# Altium schematic sheet STORAGE.SchDoc
size A4; SheetNumber: 4; SheetTotal: 6
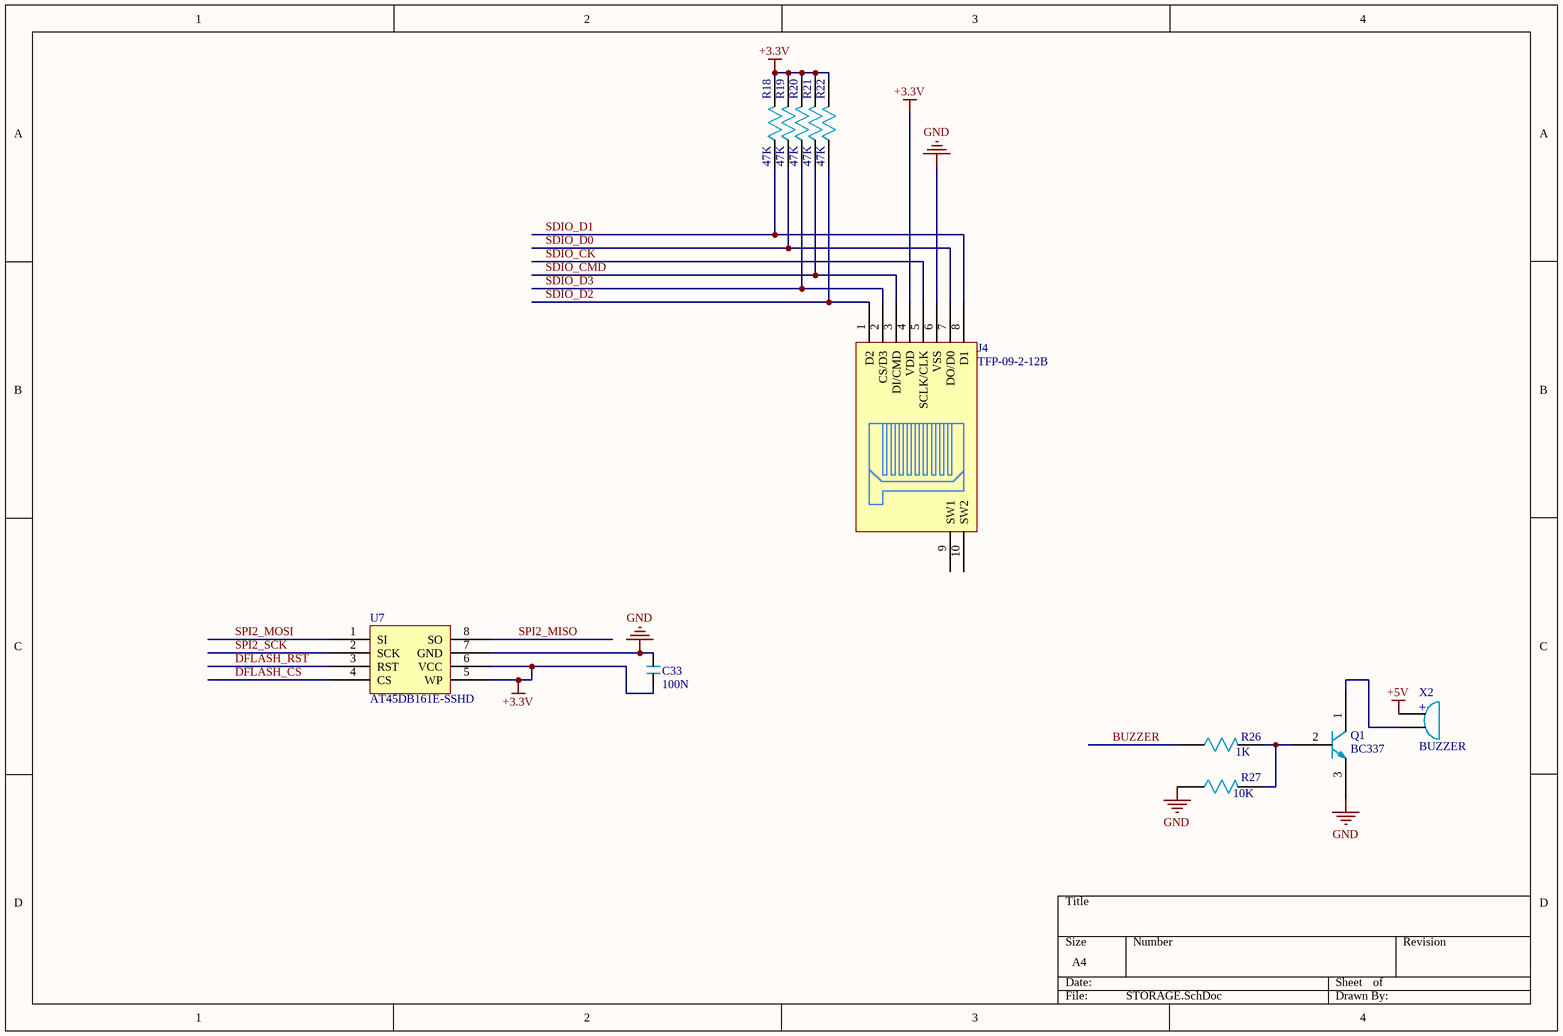
[diagram p0: STORAGE.SchDoc]

## Parts
C33  100N  [0603]
J4  TFP-09-2-12B  [TFP-09-2-12B]
Q1  BC337  [BC337]
R18  47K  [0603]
R19  47K  [0603]
R20  47K  [0603]
R21  47K  [0603]
R22  47K  [0603]
R26  1K  [0603]
R27  10K  [0603]
U7  AT45DB161E-SSHD  [8S2]
X2  BUZZER  [BUZZER]

## Nets
+3.3V: C33.2 J4.4(VDD) R18.2 R19.2 R20.2 R21.2 R22.2 U7.5(WP) U7.6(VCC)
+5V: X2.1(VCC)
GND: C33.1 J4.6(VSS) Q1.3 R27.1 U7.7(GND)
BUZZER: R26.1
DFLASH_CS: U7.4(CS)
DFLASH_RST: U7.3(RST)
SDIO_CK: J4.5(SCLK/CLK)
SDIO_CMD: J4.3(DI/CMD) R21.1
SDIO_D0: J4.7(DO/D0) R19.1
SDIO_D1: J4.8(D1) R18.1
SDIO_D2: J4.1(D2) R22.1
SDIO_D3: J4.2(CS/D3) R20.1
SPI2_MISO: U7.8(SO)
SPI2_MOSI: U7.1(SI)
SPI2_SCK: U7.2(SCK)
NetQ1_1: Q1.1 X2.2(GND)
NetQ1_2: Q1.2 R26.2 R27.2

Not connected (* = marked no-connect by the designer): J4 9(SW1) 10(SW2)

## Notes on the sheet
- (in symbol BUZZER) +

## Library data of the parts
C33 = CAP
J4 = uSD
Q1 = NPN-SMD
R18-R22 R26 R27 = RES